# Altium schematic sheet L7.SchDoc
size A4
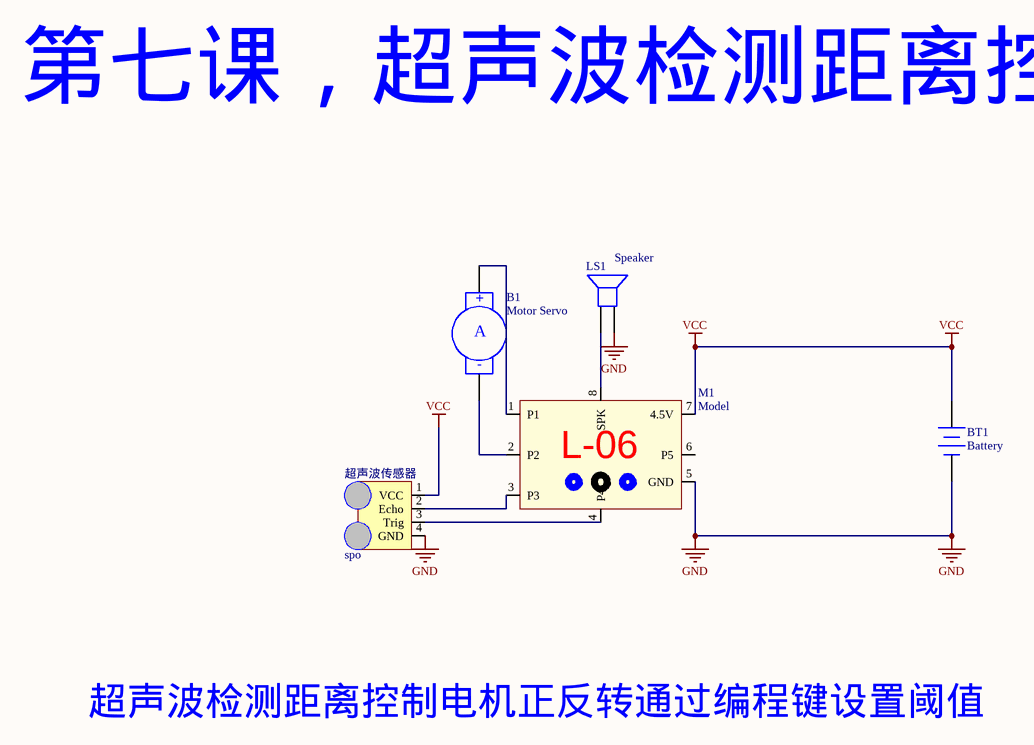
[diagram p0: L7.SchDoc]

## Parts
B1  Motor Servo  [RAD-0.4]
BT1  Battery  [BAT-2]
LS1  Speaker  [PIN2]
M1  Model
超声波传感器  spo

## Nets
GND: BT1.2(-) LS1.2 M1.5(GND) 超声波传感器.4(GND)
VCC: BT1.1(+) M1.7(4.5V) 超声波传感器.1(VCC)
NetB1_1: B1.1(+) M1.1(P1)
NetB1_2: B1.2(-) M1.2(P2)
NetLS1_1: LS1.1 M1.8(SPK)
NetM1_3: M1.3(P3) 超声波传感器.2(Echo)
NetM1_4: M1.4(P4) 超声波传感器.3(Trig)

Not connected (* = marked no-connect by the designer): M1 6(P5)

## Notes on the sheet
- Labels drawn without touching a wire or pin: L-06, 第七课，超声波检测距离控制电机, 超声波检测距离控制电机正反转通过编程键设置阈值
- (in symbol Motor Servo) A

## Library data of the parts
B1 = Motor Servo: Servo Motor; Published: 24-Mar-1999; LatestRevisionDate: 17-Jul-2002; LatestRevisionNote: Re-released for DXP Platform.; PackageReference: RAD-0.4; Publisher: Altium Limited; PackageDescription: Radial Cap, Thru-Hole; 2 Leads; 0.4 in Pin Spacing
BT1 = Battery: Multicell Battery; Published: 24-Mar-1999; LatestRevisionDate: 17-Jul-2002; LatestRevisionNote: Re-released for DXP Platform.; PackageReference: BAT-2; Publisher: Altium Limited; PackageDescription: Battery; 2 Leads
LS1 = Speaker: Loudspeaker; Published: 24-Mar-1999; LatestRevisionDate: 17-Jul-2002; LatestRevisionNote: Re-released for DXP Platform.; PackageReference: PIN2; Publisher: Altium Limited
M1 = M?: 积木模块